# EAGLE design plug-v18 (EAGLE 7.6.0)
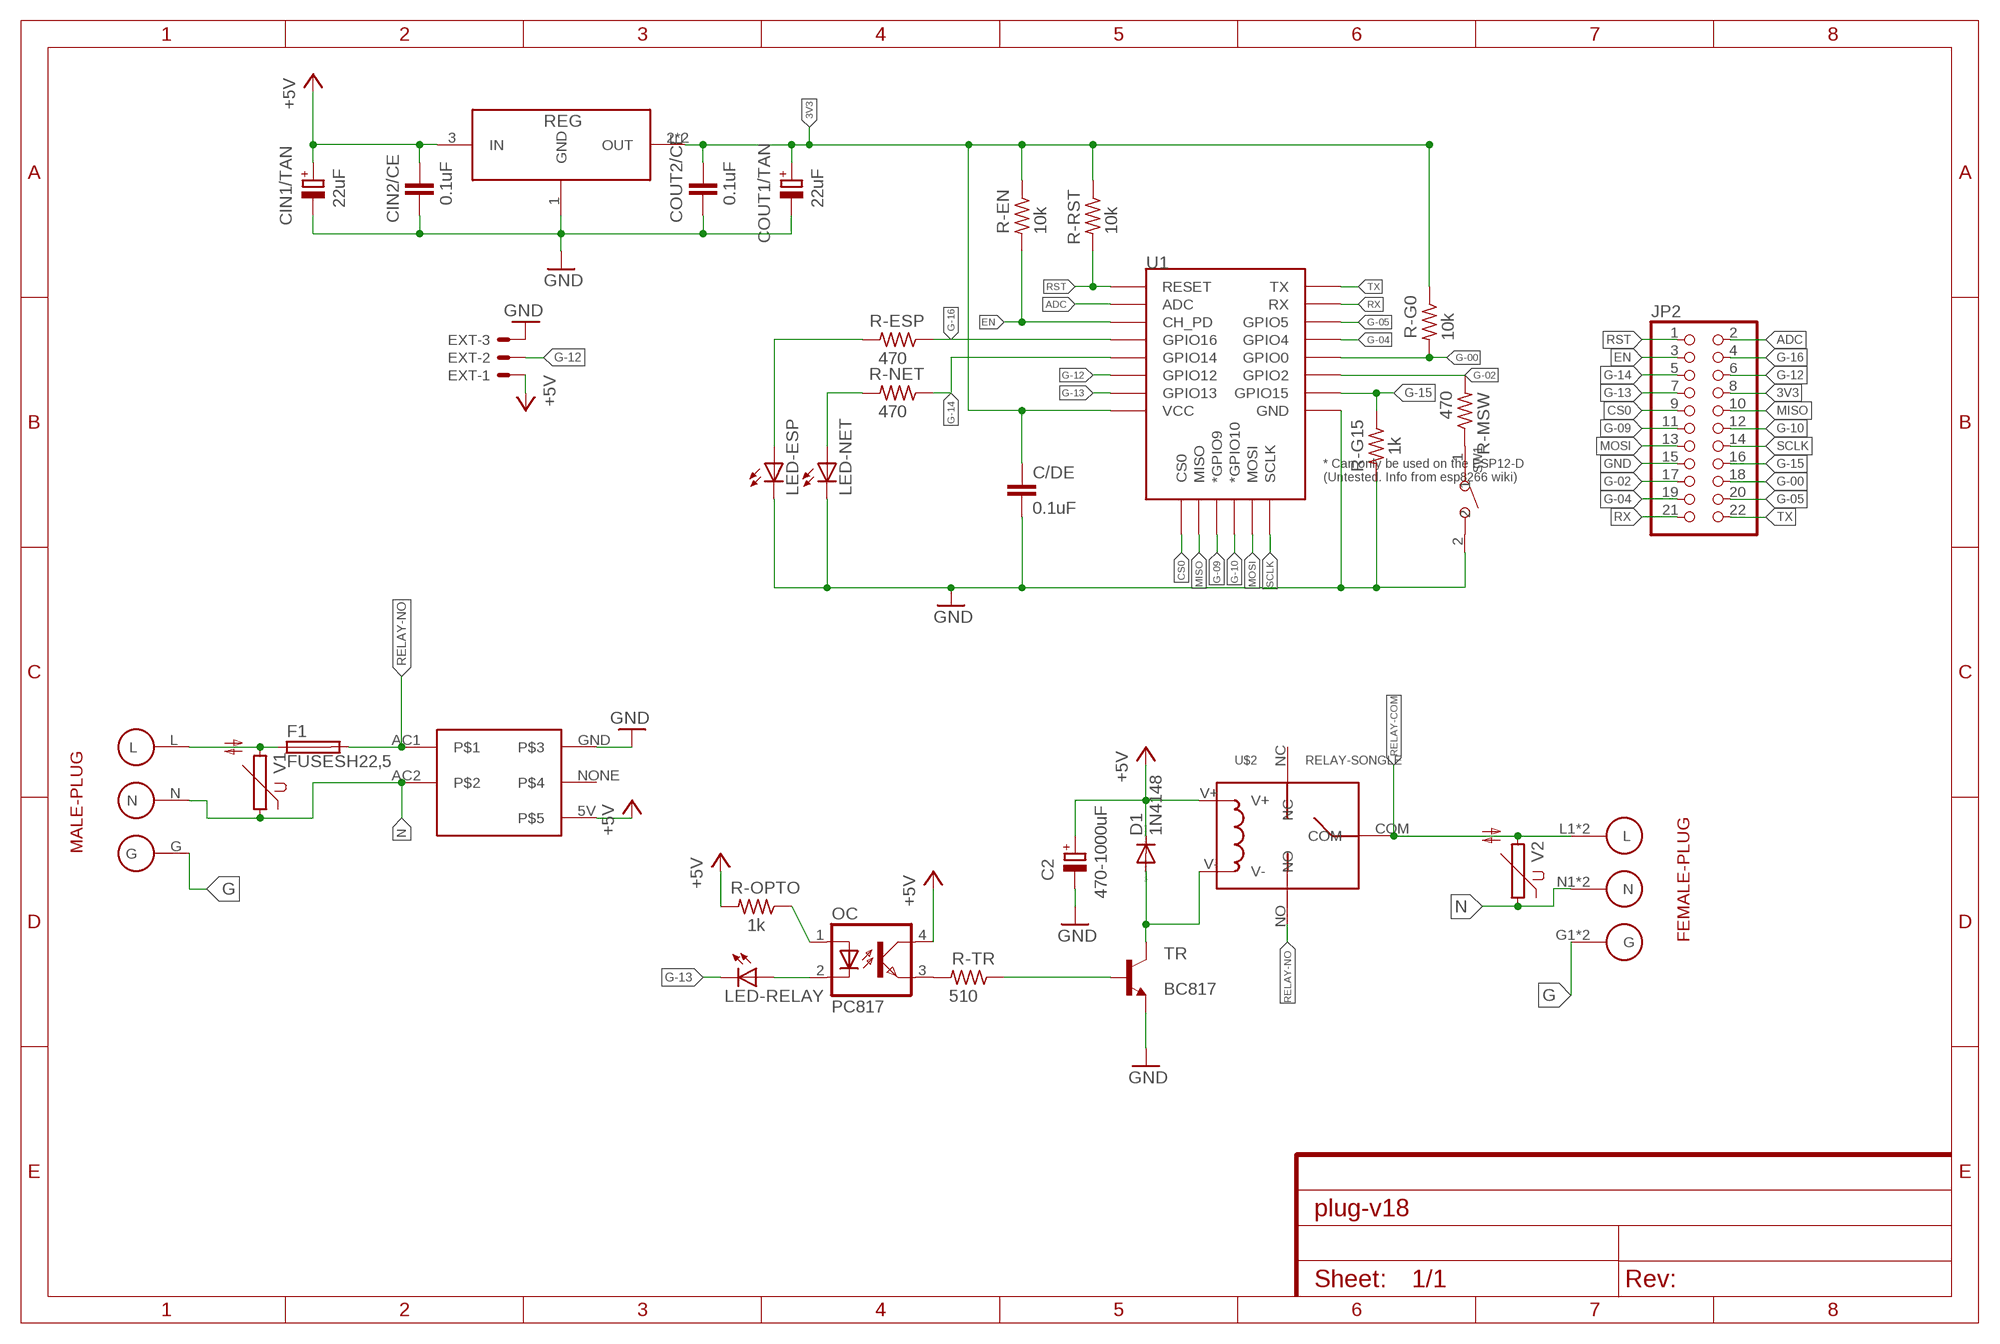
[diagram p0: schematic, sheet 1]

## Parts
C2  470-1000uF  CPOL-EUE3.5-8  [E3,5-8]
C/DE  0.1uF  C-EUC0805  [C0805]
CIN1/TAN  22uF  CPOL-EUB/3528-21R  [B/3528-21R]
CIN2/CE  0.1uF  C-EUC0805K  [C0805K]
COUT1/TAN  22uF  CPOL-EUB/3528-21R  [B/3528-21R]
COUT2/CE  0.1uF  C-EUC0805K  [C0805K]
D1  1N4148  1N4148DO35-7  [DO35-7]
EXT  53048-03  [53048-03]
F1  FUSESH22,5  [SH22,5]
JP2  PINHD-2X11  [2X11]
LED-ESP  LEDCHIPLED_0805  [CHIPLED_0805]
LED-NET  LEDCHIPLED_0805  [CHIPLED_0805]
LED-RELAY  LEDCHIPLED_0805  [CHIPLED_0805]
OC  PC817  [DIL04]
R-EN  10k  R-US_M0805  [M0805]
R-ESP  470  R-US_M0805  [M0805]
R-G0  10k  R-US_M0805  [M0805]
R-G15  1k  R-US_M0805  [M0805]
R-MSW  470  R-US_M0805  [M0805]
R-NET  470  R-US_M0805  [M0805]
R-OPTO  1k  R-US_M0805  [M0805]
R-RST  10k  R-US_M0805  [M0805]
R-TR  510  R-US_M0805  [M0805]
REG  AMS1117-3.3  [SOT-223]
SW1  DIP-BUTTON(2P-6.0X3.0X4.3MM)-TS-1101F  [SW2-5.0-6.0X3.0X4.3MM]
TR  BC817  BC817-16SMD  [SOT23-BEC]
U1  ESP12ESMD  [ESP12E-SMD]
U$2  RELAY-SONGLE  [RELAY-SONGLE]
U$3  MALE-PLUG  [MALE-PLUG]
U$4  POWERSUPPLY-5V-700MA  [POWERSUPPLY-5V-700MA]
U$5  FEMALE-PLUG  [FEMALE-PLUG]
V1  S14K11  [S14K11]
V2  S14K11  [S14K11]

## Nets
3V3: C/DE.1 COUT1/TAN.+ COUT2/CE.1 JP2.8 R-EN.1 R-G0.1 R-RST.1 REG.2(OUT) REG.4(OUT) U1.VCC
+5V: C2.+ CIN1/TAN.+ CIN2/CE.1 D1.C EXT.1 OC.4(COL) R-OPTO.2 REG.3(IN) U$2.V+ U$4.5V
ADC: JP2.2 U1.ADC
CS0: JP2.9 U1.CS0
EN: JP2.3 R-EN.2 U1.CH_PD
G: U$3.G U$5.G1(G) U$5.G2(G)
G-00: JP2.18 R-G0.2 U1.GPIO0
G-02: JP2.17 R-MSW.2 U1.GPIO2
G-04: JP2.19 U1.GPIO4
G-05: JP2.20 U1.GPIO5
G-09: JP2.11 U1.GPIO9(*GPIO9)
G-10: JP2.12 U1.GPIO10(*GPIO10)
G-12: EXT.2 JP2.6 U1.GPIO12
G-13: JP2.7 LED-RELAY.C U1.GPIO13
G-14: JP2.5 R-NET.1 U1.GPIO14
G-15: JP2.16 R-G15.1 U1.GPIO15
G-16: JP2.4 R-ESP.1 U1.GPIO16
GND: C2.- C/DE.2 CIN1/TAN.- CIN2/CE.2 COUT1/TAN.- COUT2/CE.2 EXT.3 JP2.15 LED-ESP.C LED-NET.C R-G15.2 REG.1(GND) SW1.2 TR.E U1.GND U$4.GND
LINE: F1.1 U$3.L V1.2
MISO: JP2.10 U1.MISO
MOSI: JP2.13 U1.MOSI
N: U$3.N U$4.AC2 U$5.N1(N) U$5.N2(N) V1.1 V2.1
N$1: OC.3(EMIT) R-TR.2
N$2: R-TR.1 TR.B
N$6: LED-ESP.A R-ESP.2
N$13: OC.1(A) R-OPTO.1
N$16: LED-NET.A R-NET.2
N$17: D1.A TR.C U$2.V-
N$21: LED-RELAY.A OC.2(C)
N$22: R-MSW.1 SW1.1
RELAY-COM: U$2.COM U$5.L1(L) U$5.L2(L) V2.2
RELAY-NO: F1.2 U$2.NO U$4.AC1
RST: JP2.1 R-RST.2 U1.RESET
RX: JP2.21 U1.RXD0(RX)
SCLK: JP2.14 U1.SCLK
TX: JP2.22 U1.TXD0(TX)
Unconnected: U$2.NC U$4.NONE

## Library data of the parts
C2 CIN1/TAN COUT1/TAN = rcl:CPOL-EU: POLARIZED CAPACITOR, European symbol
C/DE CIN2/CE COUT2/CE = rcl:C-EU: CAPACITOR, European symbol
D1 = diode:1N4148: DIODE high speed (Philips)
EXT = con-molex:53?-03: CONNECTOR wire to board 1.25 mm (.049 inch) pitch header; MF: WALDOM/MOLEX; MPN: 53048-0310; OC_FARNELL: 9732918; OC_NEWARK: 38C9908
F1 = fuse:FUSE: Fuse; OC_FARNELL: unknown; OC_NEWARK: unknown
JP2 = pinhead:PINHD-2X11: PIN HEADER
LED-ESP LED-NET LED-RELAY = led:LED: LED OSRAM: - CHIPLED LG R971, LG N971, LY N971, LG Q971, LY Q971, LO R971, LY R971 LH N974, LH R974 LS Q976, LO Q976, LY Q976 LO Q996 - Hyper CHIPLED LW Q18S LB Q993, LB Q99A, LB R99A - SideLED LS A670, LO A670, LY A670, LG A670, LP A670 LB A673, LV A673, LT A673, LW A673 LH A674 LY A675 LS A676, LA A676, LO A676, LY A676, LW A676 LS A679, LY A679, LG A679 - Hyper Micro SIDELED® LS Y876, LA Y876, LO Y876, LY Y876 LT Y87S - SmartLED LW L88C, LW L88S LB L89C, LB L89S, LG L890 LS L89K, LO L89K, LY L89K LS L896, LA L896, LO L896, LY L896 - TOPLED LS T670, LO T670, LY T670, LG T670, LP T670 LSG T670, LSP T670, LSY T670, LOP T670, LYG T670 LG T671, LOG T671, LSG T671 LB T673, LV T673, LT T673, LW T673 LH T674 LS T676, LA T676, LO T676, LY T676, LB T676, LH T676, LSB T676, LW T676 LB T67C, LV T67C, LT T67C, LS T67K, LO T67K, LY T67K, LW E67C LS E67B, LA E67B, LO E67B, LY E67B, LB E67C, LV E67C, LT E67C LW T67C LS T679, LY T679, LG T679 LS T770, LO T770, LY T770, LG T770, LP T770 LB T773, LV T773, LT T773, LW T773 LH T774 LS E675, LA E675, LY E675, LS T675 LS T776, LA T776, LO T776, LY T776, LB T776 LHGB T686 LT T68C, LB T68C - Hyper Mini TOPLED® LB M676 - Mini TOPLED Santana® LG M470 LS M47K, LO M47K, LY M47K Source: http://www.osram.convergy.de LUXEON: - LUMILED® LXK2-PW12-R00, LXK2-PW12-S00, LXK2-PW14-U00, LXK2-PW14-V00 LXK2-PM12-R00, LXK2-PM12-S00, LXK2-PM14-U00 LXK2-PE12-Q00, LXK2-PE12-R00, LXK2-PE12-S00, LXK2-PE14-T00, LXK2-PE14-U00 LXK2-PB12-K00, LXK2-PB12-L00, LXK2-PB12-M00, LXK2-PB14-N00, LXK2-PB14-P00, LXK2-PB14-Q00 LXK2-PR12-L00, LXK2-PR12-M00, LXK2-PR14-Q00, LXK2-PR14-R00 LXK2-PD12-Q00, LXK2-PD12-R00, LXK2-PD12-S00 LXK2-PH12-R00, LXK2-PH12-S00 LXK2-PL12-P00, LXK2-PL12-Q00, LXK2-PL12-R00 Source: www.luxeon.com KINGBRIGHT: KA-3528ASYC Source: www.kingbright.com
OC = optocoupler:PC817: SHARP OPTO COUPLER; MPN: PC817X4J000F; OC_FARNELL: 9707727; OC_NEWARK: 97K7059
R-EN R-ESP R-G0 R-G15 R-MSW R-NET R-OPTO R-RST R-TR = rcl:R-US_: RESISTOR, American symbol
REG = AMS1117-3.3:AMS1117-3.3: 1A LOW DROPOUT VOLTAGE REGULATOR
SW1 = Seeed-OPL-Switch:DIP-BUTTON(2P-6.0X3.0X4.3MM): 311020025
TR = transistor-npn:BC817*: NPN Transistor
U1 = esp8266modules:ESP12E: ESP12E Module
U$2 = Relay-Songle:RELAY-SONGLE
U$3 = Male-Female-PLUG:MALE-PLUG
U$4 = PowerSupply-5V-700mA:POWERSUPPLY-5V-700MA
U$5 = Male-Female-PLUG:FEMALE-PLUG
V1 V2 = varistor:S14K11: VARISTOR

## Board
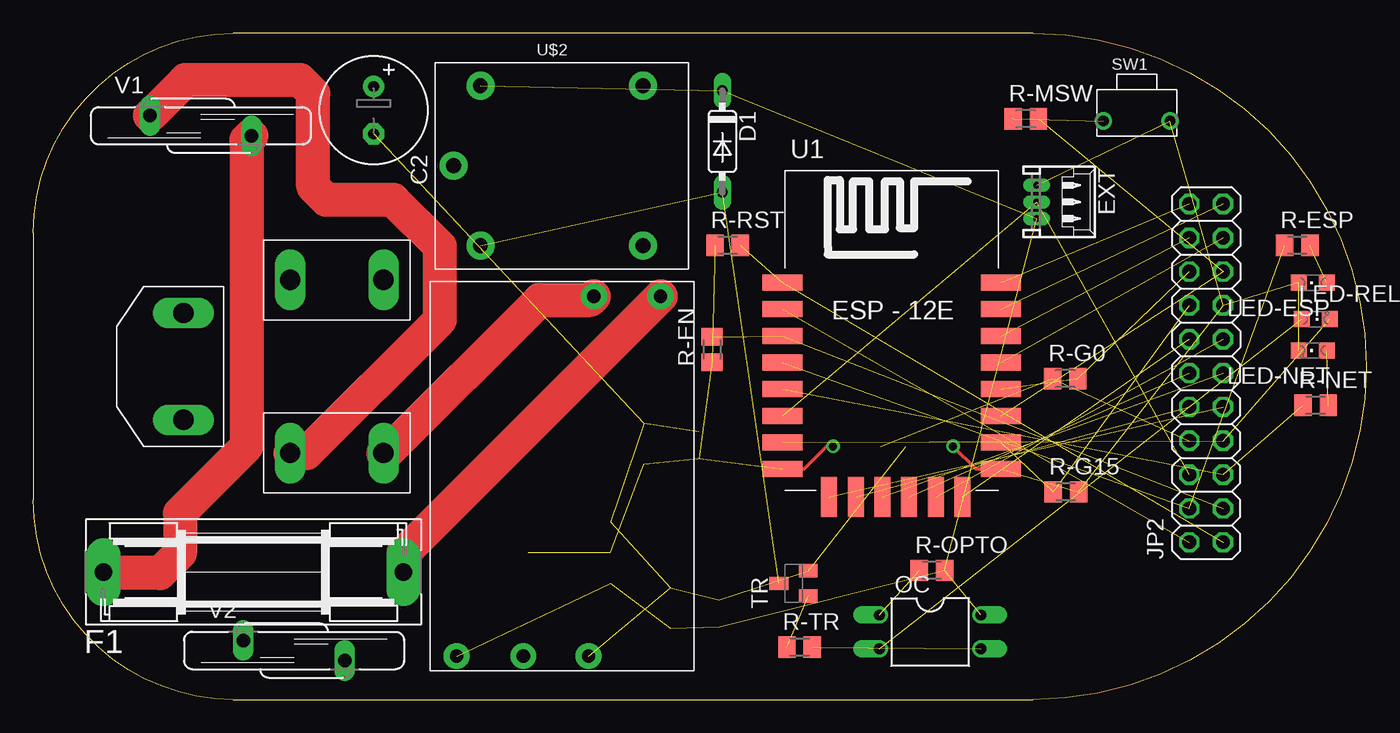
[diagram p1: board, top side]
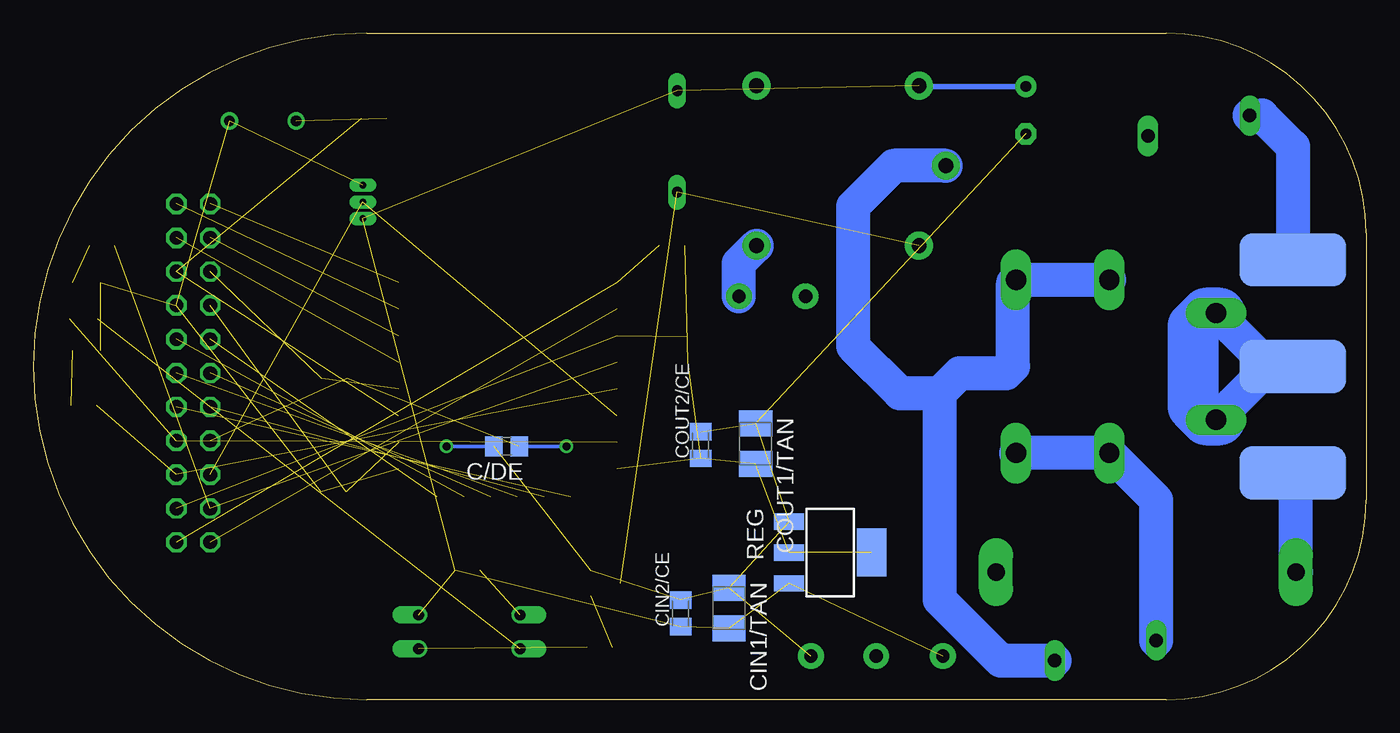
[diagram p2: board, bottom side, seen from below]

Size 100 x 50 mm. Coordinates in mm from the lower left corner, seen from the top.
Outline: 15,0 75,0 arc180 75,50 15,50 arc90 0,35 0,15 arc90 15,0
Copper layers (1*16): Top 0.035mm / dielectric 1.5mm / Bottom 0.035mm
Design rules "default": minimum track width 10mil, minimum drill 24mil, track to track 8mil, track to pad 8mil, pad to pad 8mil, via to via 8mil, smd to smd 8mil, copper to edge 40mil, drill to drill 8mil, minimum pad ring 10mil, minimum via ring 8mil, stop-mask expansion 4mil, vias tented up to drill 0mil, thermal gap 10mil

### Footprints (pad centres in the part's own frame; a part is rotated, then mirrored left to right if it is on the bottom)
E3,5-8 = drill 0.813 pad 1.6: + -1.778,0 | drill 0.813 pad 1.6 octagon: - 1.778,0
C0805 = smd 1.3 x 1.5: 1 -0.95,0; 2 0.95,0
B/3528-21R = smd 1.95 x 2.5: + 1.525,0; - -1.525,0
C0805K = smd 1.3 x 1.6: 1 -1,0; 2 1,0
DO35-7 = drill 0.813 long: A 3.81,0; C -3.81,0
53048-03 = drill 0.5 pad 0.698 long: 1 1.25,-1.25; 2 0,-1.25; 3 -1.25,-1.25
SH22,5 = drill 1.321 pad 2.54 long: 1 -11.252,0; 2 11.252,0
2X11 = drill 1.016 octagon: 1 -12.7,-1.27; 2 -12.7,1.27; 3 -10.16,-1.27; 4 -10.16,1.27; 5 -7.62,-1.27; 6 -7.62,1.27; 7 -5.08,-1.27; 8 -5.08,1.27; 9 -2.54,-1.27; 10 -2.54,1.27; 11 0,-1.27; 12 0,1.27; 13 2.54,-1.27; 14 2.54,1.27; 15 5.08,-1.27; 16 5.08,1.27; 17 7.62,-1.27; 18 7.62,1.27; 19 10.16,-1.27; 20 10.16,1.27; 21 12.7,-1.27; 22 12.7,1.27
CHIPLED_0805 = smd 1.2 x 1.2: A 0,-1.05; C 0,1.05
DIL04 = drill 0.813 offset: 1 -1.27,-3.81; 2 1.27,-3.81; 3 1.27,3.81; 4 -1.27,3.81
M0805 = smd 1.3 x 1.6: 1 -0.95,0; 2 0.95,0
SOT-223 = smd 1.219 x 2.235: 1 -2.381,-3.099; 2 -0.07,-3.099; 3 2.241,-3.099 | smd 3.6 x 2.2: 4 -0.07,3.099
SW2-5.0-6.0X3.0X4.3MM = drill 0.8 pad 1.27: 1 -2.5,0; 2 2.5,0
SOT23-BEC = smd 1 x 1.4: B -0.95,-1.1; C 0,1.1; E 0.95,-1.1
ESP12E-SMD = smd 3 x 1.2: ADC -8.3,3.8; CH_PD -8.3,1.8; GND 8.1,-8.2; GPIO0 8.1,-2.2; GPIO2 8.1,-4.2; GPIO4 8.1,-0.2; GPIO5 8.1,1.8; GPIO12 -8.3,-4.2; GPIO13 -8.3,-6.2; GPIO14 -8.3,-2.2; GPIO15 8.1,-6.2; GPIO16 -8.3,-0.2; RESET -8.3,5.8; RXD0 8.1,3.8; TXD0 8.1,5.8; VCC -8.3,-8.2 | smd 1.2 x 3: CS0 -4.8,-10.3; GPIO9 -0.8,-10.3; GPIO10 1.2,-10.3; MISO -2.8,-10.3; MOSI 3.2,-10.3; SCLK 5.2,-10.3
RELAY-SONGLE = drill 1.118 pad 2.1: COM -8.1,0; NC 6.1,6; NO 6.1,-6; V+ -6.1,6; V- -6.1,-6
MALE-PLUG = smd 8 x 4: G 0,0; L 0,8; N 0,-8
POWERSUPPLY-5V-700MA = drill 1 pad 1.93: 5V 13.5,-7.9; AC1 -13.5,7.4; AC2 -13.5,2.4; GND 13.5,2; NONE 13.5,-2.9
FEMALE-PLUG = drill 1.524 long: G1 -6.73,4; G2 -6.73,-4; L1 1.27,6.5; L2 8.27,6.5; N1 1.27,-6.5; N2 8.27,-6.5
S14K11 = drill 1.016 long: 1 -0.762,-3.81; 2 0.762,3.81

### Placement (x,y rotation side)
C2  25.53,44.23 270 top
C/DE  64.5,19 180 bottom
CIN1/TAN  47.81,6.87 270 bottom
CIN2/CE  51.43,6.47 90 bottom
COUT1/TAN  45.81,19.21 270 bottom
COUT2/CE  49.93,19.09 90 bottom
D1  51.69,41.88 270 top
EXT  76.53,37.35 270 top
F1  16.52,9.57 0 top
JP2  88,24.5 90 top
LED-ESP  96.01,31.28 90 top
LED-NET  96.01,26.2 90 top
LED-RELAY  96.21,28.54 270 top
OC  67.29,5.07 270 top
R-EN  50.92,26.27 90 top
R-ESP  94.83,34.08 0 top
R-G0  77.42,24.08 0 top
R-G15  77.47,15.58 0 top
R-MSW  74.45,43.58 0 top
R-NET  96.21,22.08 0 top
R-OPTO  67.42,9.69 0 top
R-RST  52.09,34.08 0 top
R-TR  57.49,3.93 0 top
REG  40.21,10.96 270 bottom
SW1  82.78,43.42 0 top
TR  57.04,8.72 90 top
U1  64.5,25.5 0 top
U$2  39.64,40.06 0 top
U$3  5.5,25 180 bottom
U$4  39.66,16.76 270 top
U$5  18,25 0 top
V1  12.56,43.06 270 top
V2  19.56,3.68 270 top

### Tracks (layer width: path | path; a pad name or v marks a point on that pad's centre or on a via)
3V3  (via drill 0.6)  (8 unrouted)
  Top 0.254: U1.VCC 57.8,17.3 59.5,19 v60,19
  Bottom 0.254: v60,19 C/DE.1
+5V  (8 unrouted)
  Bottom 0.406: C2.+ 33.49,46.01 U$2.V+
ADC  (1 unrouted)
CS0  (1 unrouted)
EN  (2 unrouted)
G
  Bottom 2.54: 7.27,25 U$5.G2 | U$3.G 7.27,25 | 7.27,25 U$5.G1
G-00  (2 unrouted)
G-02  (2 unrouted)
G-04  (1 unrouted)
G-05  (1 unrouted)
G-09  (1 unrouted)
G-10  (1 unrouted)
G-12  (2 unrouted)
G-13  (2 unrouted)
G-14  (2 unrouted)
G-15  (2 unrouted)
G-16  (2 unrouted)
GND  (via drill 0.6)  (14 unrouted)
  Top 0.254: U1.GND 70.7,17.3 v69,19
  Bottom 0.254: v69,19 C/DE.2
LINE
  Top 2.54: V1.2 16.3,42.3 16,42 16,19 11,14 11,11 9.5,9.5 5.34,9.5 F1.1
  Bottom 2.54: F1.1 5.27,16.77 U$3.L
MISO  (1 unrouted)
MOSI  (1 unrouted)
N
  Top 2.54: U$5.N2 26.5,18.5 38,30 41.8,30 U$4.AC2 | U$5.N1 20.5,18.5 30.5,28.5 30.5,34 27,37.5 22,37.5 21,38.5 21,45.5 20,46.5 11.43,46.5 V1.1
  Bottom 2.54: V2.1 15.75,14.98 U$5.N1 U$5.N2 | V1.1 7.82,43.82 5.5,41.5 U$3.N
N$1  (1 unrouted)
N$2  (1 unrouted)
N$6  (1 unrouted)
N$13  (1 unrouted)
N$16  (1 unrouted)
N$17  (2 unrouted)
N$21  (1 unrouted)
N$22  (1 unrouted)
RELAY-COM
  Bottom 2.54: U$5.L1 U$5.L2 26.5,31.27 26.5,25 27,24.5 30.5,24.5 32,23 32,22.5 | V2.2 27.42,2.92 32,7.5 32,22.5 | U$2.COM 35.44,40.06 38.5,37 38.5,26.5 35,23 32.5,23 32,22.5
RELAY-NO
  Top 2.54: F1.2 27.77,10.97 U$4.AC1
  Bottom 2.54: U$4.AC1 47.06,32.74 U$2.NO
RST  (2 unrouted)
RX  (1 unrouted)
SCLK  (1 unrouted)
TX  (1 unrouted)